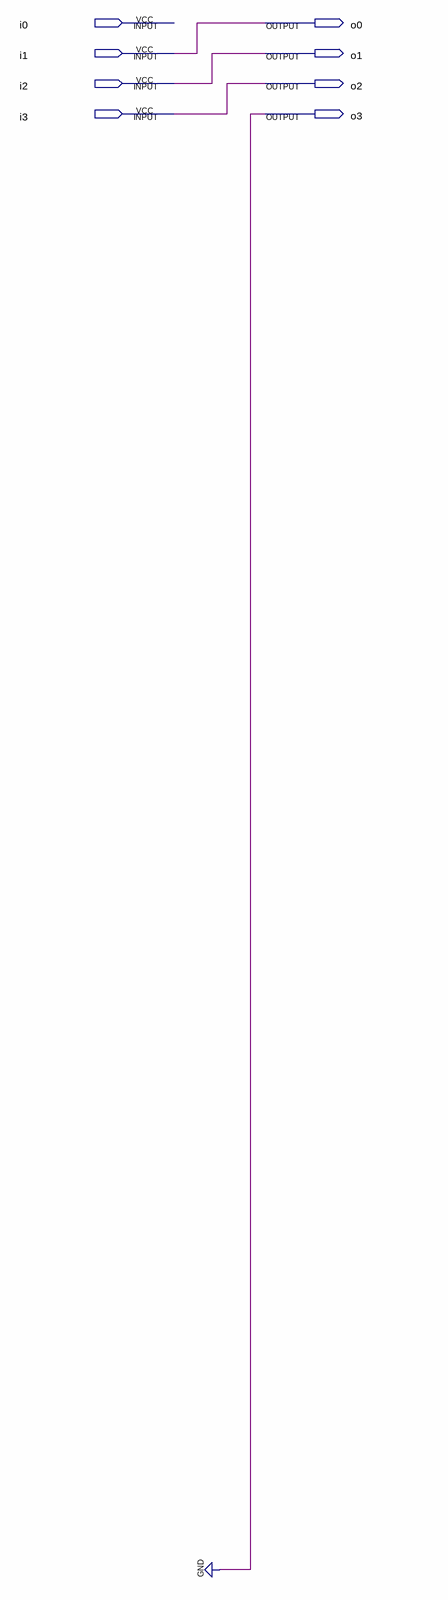
[diagram p0: schematic sheet]
// Quartus schematic divisor.bdf as structural Verilog: 0 symbols, 8 pins
module divisor (
  input  i0,
  input  i1,
  input  i2,
  input  i3,
  output o0,
  output o1,
  output o2,
  output o3
);


  assign o0 = i1;
  assign o1 = i2;
  assign o2 = i3;
  assign o3 = 1'b0;
endmodule
